# Altium schematic sheet Control.SchDoc
size A2
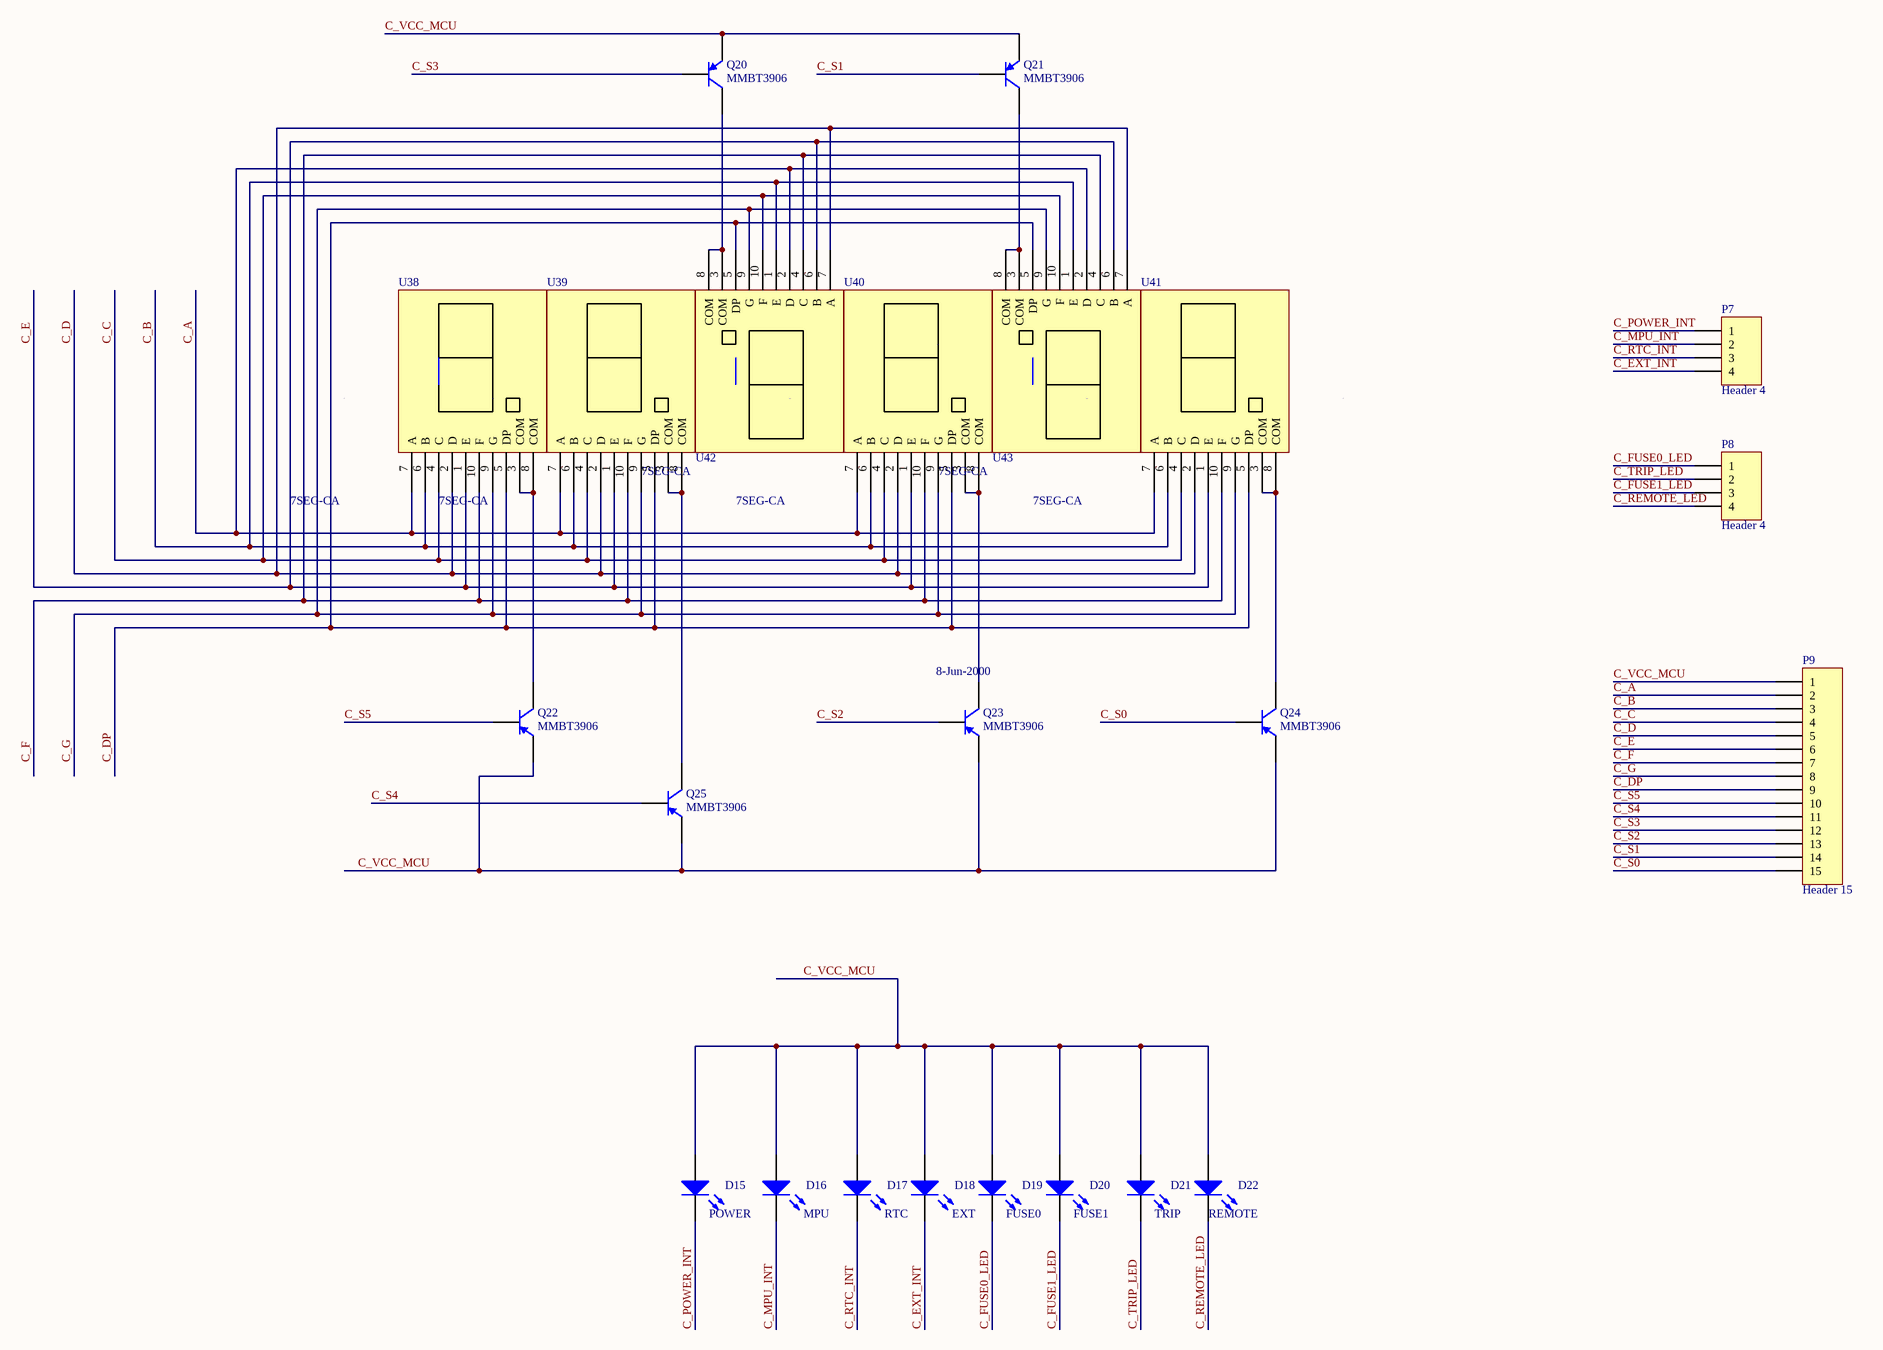
[diagram p0: Control.SchDoc]

## Parts
D15  Infor: POWER  [0603D]  (hidden comment: LED)
D16  Info: MPU  [0603D]  (hidden comment: LED)
D17  Info: RTC  [0603D]  (hidden comment: LED)
D18  Info: EXT  [0603D]  (hidden comment: LED)
D19  Info: FUSE0  [0603D]  (hidden comment: LED)
D20  Info: FUSE1  [0603D]  (hidden comment: LED)
D21  Info: TRIP  [0603D]  (hidden comment: LED)
D22  Info: REMOTE  [0603D]  (hidden comment: LED)
P7  Header 4  [HDR1X4]
P8  Header 4  [HDR1X4]
P9  Header 15  [HDR1X15]
Q20  MMBT3906  [SOT23-3-PNP]
Q21  MMBT3906  [SOT23-3-PNP]
Q22  MMBT3906  [SOT23-3-PNP]
Q23  MMBT3906  Published: 8-Jun-2000  [SOT23-3-PNP]
Q24  MMBT3906  [SOT23-3-PNP]
Q25  MMBT3906  [SOT23-3-PNP]
U38  7SEG-CA  [8SEC-CA-28]
U39  7SEG-CA  [8SEC-CA-28]
U40  7SEG-CA  [8SEC-CA-28]
U41  7SEG-CA  [8SEC-CA-28]
U42  7SEG-CA  [8SEC-CA-28]
U43  7SEG-CA  [8SEC-CA-28]

## Nets
C_A: P9.2 U38.7(A) U39.7(A) U40.7(A) U41.7(A) U42.2(D) U43.2(D)
C_B: P9.3 U38.6(B) U39.6(B) U40.6(B) U41.6(B) U42.1(E) U43.1(E)
C_C: P9.4 U38.4(C) U39.4(C) U40.4(C) U41.4(C) U42.10(F) U43.10(F)
C_D: P9.5 U38.2(D) U39.2(D) U40.2(D) U41.2(D) U42.7(A) U43.7(A)
C_DP: P9.9 U38.5(DP) U39.5(DP) U40.5(DP) U41.5(DP) U42.5(DP) U43.5(DP)
C_E: P9.6 U38.1(E) U39.1(E) U40.1(E) U41.1(E) U42.6(B) U43.6(B)
C_EXT_INT: D18.2(K) P7.4
C_F: P9.7 U38.10(F) U39.10(F) U40.10(F) U41.10(F) U42.4(C) U43.4(C)
C_FUSE0_LED: D19.2(K) P8.1
C_FUSE1_LED: D20.2(K) P8.3
C_G: P9.8 U38.9(G) U39.9(G) U40.9(G) U41.9(G) U42.9(G) U43.9(G)
C_MPU_INT: D16.2(K) P7.2
C_POWER_INT: D15.2(K) P7.1
C_REMOTE_LED: D22.2(K) P8.4
C_RTC_INT: D17.2(K) P7.3
C_S0: P9.15 Q24.2(B)
C_S1: P9.14 Q21.2(B)
C_S2: P9.13 Q23.2(B)
C_S3: P9.12 Q20.2(B)
C_S4: P9.11 Q25.2(B)
C_S5: P9.10 Q22.2(B)
C_TRIP_LED: D21.2(K) P8.2
C_VCC_MCU: D15.1(A) D16.1(A) D17.1(A) D18.1(A) D19.1(A) D20.1(A) D21.1(A) D22.1(A) P9.1 Q20.3(E) Q21.3(E) Q22.3(E) Q23.3(E) Q24.3(E) Q25.3(E)
NetQ20_1: Q20.1(C) U42.3(COM) U42.8(COM)
NetQ21_1: Q21.1(C) U43.3(COM) U43.8(COM)
NetQ22_1: Q22.1(C) U38.3(COM) U38.8(COM)
NetQ23_1: Q23.1(C) U40.3(COM) U40.8(COM)
NetQ24_1: Q24.1(C) U41.3(COM) U41.8(COM)
NetQ25_1: Q25.1(C) U39.3(COM) U39.8(COM)

## Library data of the parts
D15 D18-D22 = LED2: Typical RED, GREEN, YELLOW, AMBER GaAs LED; Published: 8-Jun-2000; LatestRevisionDate: 17-Jul-2002; LatestRevisionNote: Re-released for DXP Platform.; PackageVersion: Feb-2002; PackageReference: 3.2X1.6X1.1; Publisher: Altium Limited; PackageDescription: SM LED; 2 Flat Leads
  D15: Value: Yellow
  D18: Value: Green
  D19-D22: Value: Red
D16 D17 = LED2: Typical RED, GREEN, YELLOW, AMBER GaAs LED; Value: Blue; Published: 8-Jun-2000; LatestRevisionDate: 17-Jul-2002; LatestRevisionNote: Re-released for DXP Platform.; PackageVersion: Feb-2002; PackageReference: 3.2X1.6X1.1; Publisher: Altium Limited; PackageDescription: SM LED; 2 Flat Leads
P7 P8 = Header 4: Header, 4-Pin; LatestRevisionDate: 17-Jul-2002; LatestRevisionNote: Re-released for DXP Platform.; Publisher: Altium Limited
P9 = Header 15: Header, 15-Pin; LatestRevisionDate: 17-Jul-2002; LatestRevisionNote: Re-released for DXP Platform.; Publisher: Altium Limited
Q20-Q25 = PNP: PNP Bipolar Transistor; LatestRevisionDate: 29-May-2009; LatestRevisionNote: IPC-7351 Footprint Added.; PackageVersion: Aug-1999; PackageReference: SOT-23B; Publisher: Altium Limited; PackageDescription: 3-Pin SOT-23 Package 0.95 mm Pitch, 2.4 mm Lead Span
  Q20-Q22 Q24 Q25: Published: 8-Jun-2000